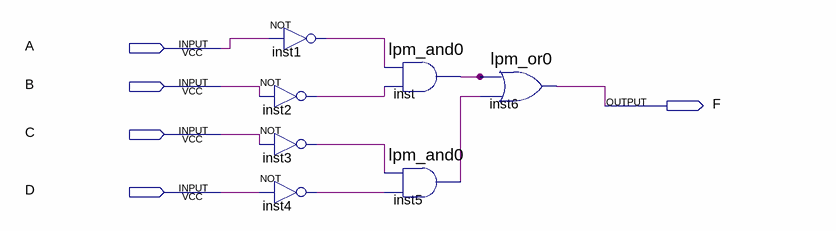
[diagram p0: schematic sheet]
// Quartus schematic lab2.bdf as structural Verilog: 7 symbols, 5 pins
module lab2 (
  input  A,
  input  B,
  input  C,
  input  D,
  output F
);

  wire inst1_out, inst2_out, inst3_out, inst4_out, inst5_result, inst_result;

  not inst1 (inst1_out, A);
  not inst2 (inst2_out, B);
  not inst3 (inst3_out, C);
  not inst4 (inst4_out, D);
  lpm_and0 inst (.data0(inst1_out), .data1(inst2_out), .result(inst_result));
  lpm_and0 inst5 (.data0(inst3_out), .data1(inst4_out), .result(inst5_result));
  lpm_or0 inst6 (.data0(inst_result), .data1(inst5_result), .result(F));
endmodule
